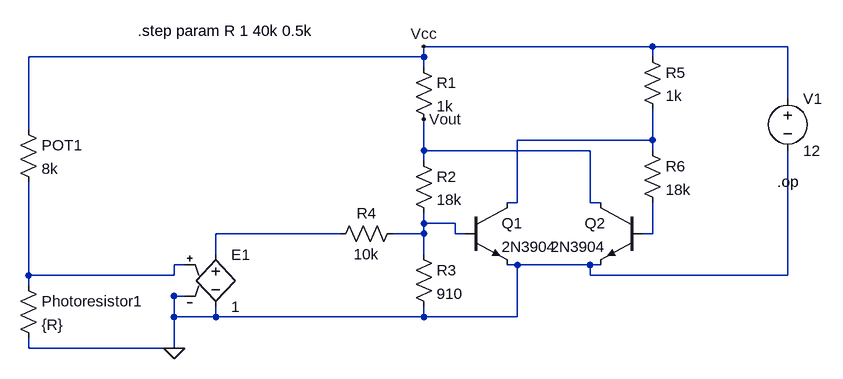
[diagram p0: schematic schmitt_trigger_bjts_2.asc]
schmitt_trigger_bjts_2.asc, the LTspice schematic file:
Version 4.1
SHEET 1 880 680
WIRE -368 416 -368 432
WIRE -416 400 -432 400
WIRE -656 464 -656 480
WIRE 80 352 96 352
WIRE 224 352 208 352
WIRE -48 416 -48 432
WIRE 512 176 512 192
WIRE -368 432 -432 432
WIRE -432 432 -432 400
WIRE -432 400 -432 480
WIRE -432 480 -656 480
WIRE -368 432 -48 432
WIRE -48 432 96 432
WIRE 96 432 96 352
WIRE 96 352 208 352
WIRE 208 352 208 368
WIRE 208 368 512 368
WIRE 512 368 512 192
FLAG -432 480 0
WIRE 80 256 96 256
WIRE 304 112 304 128
WIRE 304 176 304 160
WIRE 96 256 96 160
WIRE 96 160 304 160
WIRE 304 160 304 128
WIRE -368 336 -368 320
WIRE -176 304 -192 304
WIRE -368 320 -368 304
WIRE -368 304 -192 304
WIRE 16 304 0 304
WIRE -48 272 -48 288
WIRE -48 336 -48 320
WIRE -96 304 -80 304
WIRE 0 304 0 288
WIRE 0 288 -48 288
WIRE -48 288 -48 320
WIRE -48 288 -48 304
WIRE -48 304 -80 304
WIRE 288 304 304 304
WIRE 304 256 304 272
WIRE 304 304 304 272
WIRE -416 352 -432 352
WIRE -656 224 -656 240
WIRE -656 384 -656 368
WIRE -432 352 -432 368
WIRE -432 368 -656 368
WIRE -656 368 -656 240
WIRE -656 144 -656 128
WIRE -48 48 -48 32
WIRE 304 32 304 16
WIRE 512 96 512 80
WIRE -656 128 -656 32
WIRE -656 32 -48 32
WIRE -48 32 -48 16
WIRE -48 16 304 16
WIRE 304 16 512 16
WIRE 512 16 512 80
FLAG -48 16 Vcc
WIRE 224 256 208 256
WIRE -48 128 -48 144
WIRE -48 192 -48 176
WIRE 208 256 208 176
WIRE 208 176 -48 176
WIRE -48 176 -48 144
FLAG -48 128 Vout
SYMBOL res -64 32 R0
SYMATTR InstName R1
SYMATTR Value 1k
SYMBOL res -64 176 R0
SYMATTR InstName R2
SYMATTR Value 18k
SYMBOL res -64 320 R0
SYMATTR InstName R3
SYMATTR Value 910
SYMBOL res -80 288 R90
WINDOW 0 0 56 VBottom 2
WINDOW 3 32 56 VTop 2
SYMATTR InstName R4
SYMATTR Value 10k
SYMBOL res 288 16 R0
SYMATTR InstName R5
SYMATTR Value 1k
SYMBOL res 288 160 R0
SYMATTR InstName R6
SYMATTR Value 18k
SYMBOL npn 16 256 R0
SYMATTR InstName Q1
SYMATTR Value 2N3904
SYMBOL npn 288 256 M0
SYMATTR InstName Q2
SYMATTR Value 2N3904
SYMBOL voltage 512 80 R0
WINDOW 123 0 0 Left 2
WINDOW 39 0 0 Left 2
SYMATTR InstName V1
SYMATTR Value 12
SYMBOL res -672 368 R0
SYMATTR InstName Photoresistor1
SYMATTR Value {R}
SYMBOL res -672 128 R0
SYMATTR InstName POT1
SYMATTR Value 8k
SYMATTR SpiceLine tol=1 pwr=0.1
SYMBOL e -368 320 R0
SYMATTR InstName E1
SYMATTR Value 1
TEXT 496 224 Left 2 !.op
TEXT -488 -8 Left 2 !.step param R 1 40k 0.5k

The netlist it stands for:
* schmitt_trigger_bjts_2.asc
R1 Vcc Vout 1k
R2 Vout N003 18k
R3 N003 0 910
R4 N003 N002 10k
R5 Vcc N001 1k
R6 N001 N004 18k
Q1 N001 N003 0 0 2N3904
Q2 Vout N004 0 0 2N3904
V1 Vcc 0 12
R§Photoresistor1 N005 0 {R}
R§POT1 Vcc N005 8k tol=1 pwr=0.1
E1 N002 0 N005 0 1
.model NPN NPN
.model PNP PNP
.lib standard.bjt
.op
.step param R 1 40k 0.5k
.backanno
.end